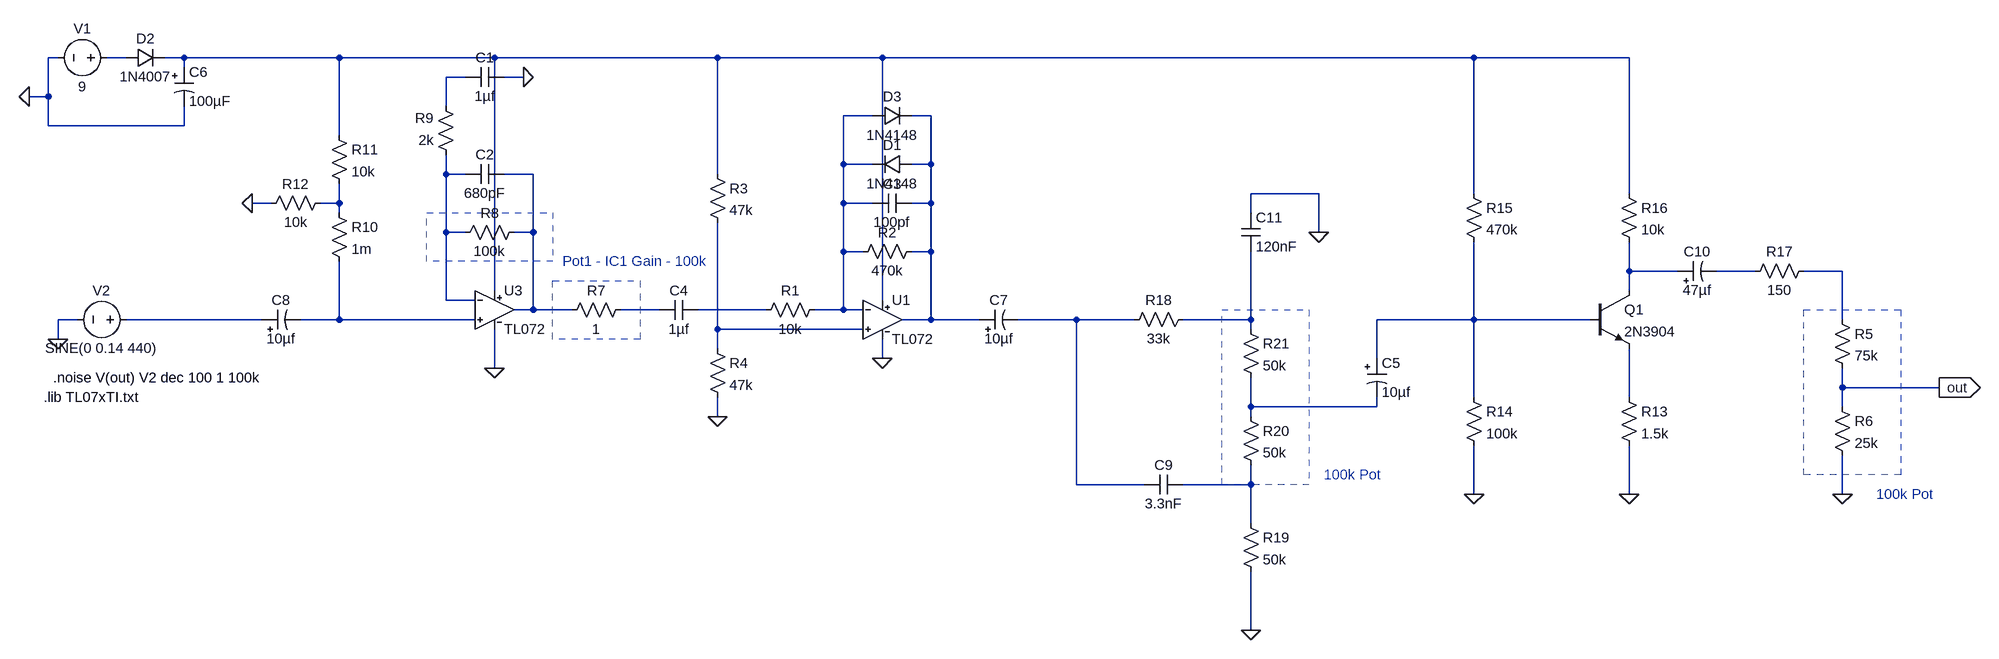
[diagram p0: schematic 7162024_3.asc]
7162024_3.asc, the LTspice schematic file:
Version 4
SHEET 1 3632 1060
WIRE 432 -336 416 -336
WIRE 544 -336 512 -336
WIRE 640 -336 608 -336
WIRE 896 -336 640 -336
WIRE 1152 -336 896 -336
WIRE 1520 -336 1152 -336
WIRE 1792 -336 1520 -336
WIRE 2768 -336 1792 -336
WIRE 3024 -336 2768 -336
WIRE 640 -320 640 -336
WIRE 1104 -304 1072 -304
WIRE 1200 -304 1168 -304
WIRE 416 -272 416 -336
WIRE 416 -272 384 -272
WIRE 1072 -256 1072 -304
WIRE 1776 -240 1728 -240
WIRE 1872 -240 1840 -240
WIRE 416 -224 416 -272
WIRE 640 -224 640 -256
WIRE 640 -224 416 -224
WIRE 896 -208 896 -336
WIRE 1728 -160 1728 -240
WIRE 1776 -160 1728 -160
WIRE 1872 -160 1872 -240
WIRE 1872 -160 1840 -160
WIRE 1072 -144 1072 -176
WIRE 1104 -144 1072 -144
WIRE 1216 -144 1168 -144
WIRE 1520 -144 1520 -336
WIRE 2512 -112 2400 -112
WIRE 2768 -112 2768 -336
WIRE 3024 -112 3024 -336
WIRE 784 -96 752 -96
WIRE 896 -96 896 -128
WIRE 896 -96 864 -96
WIRE 1728 -96 1728 -160
WIRE 1776 -96 1728 -96
WIRE 1872 -96 1872 -160
WIRE 1872 -96 1840 -96
WIRE 896 -80 896 -96
WIRE 2400 -80 2400 -112
WIRE 1072 -48 1072 -144
WIRE 1104 -48 1072 -48
WIRE 1216 -48 1216 -144
WIRE 1216 -48 1184 -48
WIRE 2512 -48 2512 -112
WIRE 1728 -16 1728 -96
WIRE 1760 -16 1728 -16
WIRE 1872 -16 1872 -96
WIRE 1872 -16 1840 -16
WIRE 3024 16 3024 -32
WIRE 3104 16 3024 16
WIRE 3232 16 3168 16
WIRE 3376 16 3312 16
WIRE 1152 48 1152 -336
WIRE 3024 48 3024 16
WIRE 1072 64 1072 -48
WIRE 1120 64 1072 64
WIRE 1792 64 1792 -336
WIRE 1216 80 1216 -48
WIRE 1216 80 1184 80
WIRE 1280 80 1216 80
WIRE 1424 80 1360 80
WIRE 1600 80 1488 80
WIRE 1728 80 1728 -16
WIRE 1728 80 1680 80
WIRE 1760 80 1728 80
WIRE 464 96 432 96
WIRE 768 96 544 96
WIRE 896 96 896 0
WIRE 896 96 832 96
WIRE 1120 96 896 96
WIRE 1872 96 1872 -16
WIRE 1872 96 1824 96
WIRE 1952 96 1872 96
WIRE 2112 96 2016 96
WIRE 2208 96 2112 96
WIRE 2400 96 2400 -16
WIRE 2400 96 2288 96
WIRE 2768 96 2768 -32
WIRE 2768 96 2608 96
WIRE 2960 96 2768 96
WIRE 3376 96 3376 16
WIRE 1520 112 1520 -64
WIRE 1760 112 1520 112
WIRE 2400 112 2400 96
WIRE 432 128 432 96
WIRE 1520 144 1520 112
WIRE 1792 160 1792 128
WIRE 2608 160 2608 96
WIRE 1152 176 1152 112
WIRE 3376 208 3376 176
WIRE 3536 208 3376 208
WIRE 2768 224 2768 96
WIRE 3024 224 3024 144
WIRE 2400 240 2400 192
WIRE 2608 240 2608 224
WIRE 2608 240 2400 240
WIRE 3376 240 3376 208
WIRE 1520 256 1520 224
WIRE 2400 256 2400 240
WIRE 2112 368 2112 96
WIRE 2224 368 2112 368
WIRE 2400 368 2400 336
WIRE 2400 368 2288 368
WIRE 2768 384 2768 304
WIRE 3024 384 3024 304
WIRE 3376 384 3376 320
WIRE 2400 432 2400 368
WIRE 2400 608 2400 512
FLAG 384 -272 0
FLAG 432 128 0
FLAG 2512 -48 0
FLAG 2400 608 0
FLAG 752 -96 0
FLAG 1200 -304 0
FLAG 1152 176 0
FLAG 1792 160 0
FLAG 1520 256 0
FLAG 3536 208 out
IOPIN 3536 208 Out
FLAG 3376 384 0
FLAG 3024 384 0
FLAG 2768 384 0
SYMBOL voltage 528 -336 R90
WINDOW 0 -32 56 VBottom 2
WINDOW 3 32 56 VTop 2
WINDOW 123 0 0 Left 0
WINDOW 39 0 0 Left 0
SYMATTR InstName V1
SYMATTR Value 9
SYMBOL diode 544 -320 R270
WINDOW 0 32 32 VTop 2
WINDOW 3 0 32 VBottom 2
SYMATTR InstName D2
SYMATTR Value 1N4007
SYMBOL polcap 624 -320 R0
SYMATTR InstName C6
SYMATTR Value 100µF
SYMBOL voltage 560 96 R90
WINDOW 0 -32 56 VBottom 2
WINDOW 3 32 56 VTop 2
WINDOW 123 0 0 Left 0
WINDOW 39 60 56 VTop 2
SYMATTR InstName V2
SYMATTR Value SINE(0 0.14 440)
SYMBOL res 2304 80 R90
WINDOW 0 0 56 VBottom 2
WINDOW 3 32 56 VTop 2
SYMATTR InstName R18
SYMATTR Value 33k
SYMBOL cap 2288 352 R90
WINDOW 0 0 32 VBottom 2
WINDOW 3 32 32 VTop 2
SYMATTR InstName C9
SYMATTR Value 3.3nF
SYMBOL res 2384 416 R0
SYMATTR InstName R19
SYMATTR Value 50k
SYMBOL res 2384 240 R0
SYMATTR InstName R20
SYMATTR Value 50k
SYMBOL res 2384 96 R0
SYMATTR InstName R21
SYMATTR Value 50k
SYMBOL cap 2384 -80 R0
SYMATTR InstName C11
SYMATTR Value 120nF
SYMBOL TL07x_Series_Opamps\\TL072 1152 16 R0
SYMATTR InstName U3
SYMBOL res 1088 -160 R180
WINDOW 0 36 76 Left 2
WINDOW 3 36 40 Left 2
SYMATTR InstName R9
SYMATTR Value 2k
SYMBOL res 880 -96 R0
SYMATTR InstName R10
SYMATTR Value 1m
SYMBOL res 880 -224 R0
SYMATTR InstName R11
SYMATTR Value 10k
SYMBOL res 880 -112 R90
WINDOW 0 0 56 VBottom 2
WINDOW 3 32 56 VTop 2
SYMATTR InstName R12
SYMATTR Value 10k
SYMBOL polcap 768 112 R270
WINDOW 0 32 32 VTop 2
WINDOW 3 0 32 VBottom 2
SYMATTR InstName C8
SYMATTR Value 10µf
SYMBOL cap 1168 -160 R90
WINDOW 0 0 32 VBottom 2
WINDOW 3 32 32 VTop 2
SYMATTR InstName C2
SYMATTR Value 680pF
SYMBOL TL07x_Series_Opamps\\TL072 1792 32 R0
SYMATTR InstName U1
SYMBOL res 1696 64 R90
WINDOW 0 0 56 VBottom 2
WINDOW 3 32 56 VTop 2
SYMATTR InstName R1
SYMATTR Value 10k
SYMBOL res 1856 -32 R90
WINDOW 0 0 56 VBottom 2
WINDOW 3 32 56 VTop 2
SYMATTR InstName R2
SYMATTR Value 470k
SYMBOL cap 1840 -112 R90
WINDOW 0 0 32 VBottom 2
WINDOW 3 32 32 VTop 2
SYMATTR InstName C3
SYMATTR Value 100pf
SYMBOL res 1504 -160 R0
SYMATTR InstName R3
SYMATTR Value 47k
SYMBOL res 1504 128 R0
SYMATTR InstName R4
SYMATTR Value 47k
SYMBOL polcap 1952 112 R270
WINDOW 0 32 32 VTop 2
WINDOW 3 0 32 VBottom 2
SYMATTR InstName C7
SYMATTR Value 10µf
SYMBOL res 3360 80 R0
SYMATTR InstName R5
SYMATTR Value 75k
SYMBOL res 3360 224 R0
SYMATTR InstName R6
SYMATTR Value 25k
SYMBOL res 1200 -64 R90
WINDOW 0 0 56 VBottom 2
WINDOW 3 32 56 VTop 2
SYMATTR InstName R8
SYMATTR Value 100k
SYMBOL diode 1840 -176 R90
WINDOW 0 0 32 VBottom 2
WINDOW 3 32 32 VTop 2
SYMATTR InstName D1
SYMATTR Value 1N4148
SYMBOL diode 1776 -224 R270
WINDOW 0 32 32 VTop 2
WINDOW 3 0 32 VBottom 2
SYMATTR InstName D3
SYMATTR Value 1N4148
SYMBOL cap 1168 -320 R90
WINDOW 0 0 32 VBottom 2
WINDOW 3 32 32 VTop 2
SYMATTR InstName C1
SYMATTR Value 1µf
SYMBOL res 1376 64 R90
WINDOW 0 0 56 VBottom 2
WINDOW 3 32 56 VTop 2
SYMATTR InstName R7
SYMATTR Value 1
SYMBOL cap 1488 64 R90
WINDOW 0 0 32 VBottom 2
WINDOW 3 32 32 VTop 2
SYMATTR InstName C4
SYMATTR Value 1µf
SYMBOL polcap 2592 160 R0
SYMATTR InstName C5
SYMATTR Value 10µf
SYMBOL npn 2960 48 R0
SYMATTR InstName Q1
SYMATTR Value 2N3904
SYMBOL res 3008 208 R0
SYMATTR InstName R13
SYMATTR Value 1.5k
SYMBOL res 2752 208 R0
SYMATTR InstName R14
SYMATTR Value 100k
SYMBOL res 2752 -128 R0
SYMATTR InstName R15
SYMATTR Value 470k
SYMBOL res 3008 -128 R0
SYMATTR InstName R16
SYMATTR Value 10k
SYMBOL polcap 3104 32 R270
WINDOW 0 32 32 VTop 2
WINDOW 3 0 32 VBottom 2
SYMATTR InstName C10
SYMATTR Value 47µf
SYMBOL res 3328 0 R90
WINDOW 0 0 56 VBottom 2
WINDOW 3 32 56 VTop 2
SYMATTR InstName R17
SYMATTR Value 150
TEXT 424 192 Left 2 !.noise V(out) V2 dec 100 1 100k
TEXT 2520 352 Left 2 ;100k Pot
TEXT 408 224 Left 2 !.lib TL07xTI.txt
TEXT 3432 384 Left 2 ;100k Pot
TEXT 1264 0 Left 2 ;Pot1 - IC1 Gain - 100k
RECTANGLE Normal 2496 368 2352 80 2
RECTANGLE Normal 3472 352 3312 80 2
RECTANGLE Normal 1248 0 1040 -80 2
RECTANGLE Normal 1392 128 1248 32 2

The netlist it stands for:
* 7162024_3.asc
V1 N001 0 9
D2 N001 N002 1N4007
C6 N002 0 100µF
V2 N014 0 SINE(0 0.14 440)
R18 N017 N016 33k
C9 N022 N016 3.3nF
R19 N022 0 50k
R20 N021 N022 50k
R21 N017 N021 50k
C11 0 N017 120nF
XU3 N015 N006 N007 N002 0 TL072  ; pins In+ In- OUT V+ V-
R9 N006 N003 2k
R10 N008 N015 1m
R11 N002 N008 10k
R12 N008 0 10k
C8 N014 N015 10µf
C2 N007 N006 680pF
XU1 N019 N004 N005 N002 0 TL072  ; pins In+ In- OUT V+ V-
R1 N004 N013 10k
R2 N005 N004 470k
C3 N005 N004 100pf
R3 N002 N019 47k
R4 N019 0 47k
C7 N005 N016 10µf
R5 N011 out 75k
R6 out 0 25k
R8 N007 N006 100k
D1 N005 N004 1N4148
D3 N004 N005 1N4148
C1 0 N003 1µf
R7 N012 N007 1
C4 N013 N012 1µf
C5 N018 N021 10µf
Q1 N009 N018 N020 0 2N3904
R13 N020 0 1.5k
R14 N018 0 100k
R15 N002 N018 470k
R16 N002 N009 10k
C10 N009 N010 47µf
R17 N011 N010 150
.model D D
.lib standard.dio
.model NPN NPN
.model PNP PNP
.lib standard.bjt
.noise V(out) V2 dec 100 1 100k
* 100k Pot
.lib TL07xTI.txt
* 100k Pot
* Pot1 - IC1 Gain - 100k
.backanno
.end